# EAGLE design SolarBase731-atmega-v00 (EAGLE 5.10)
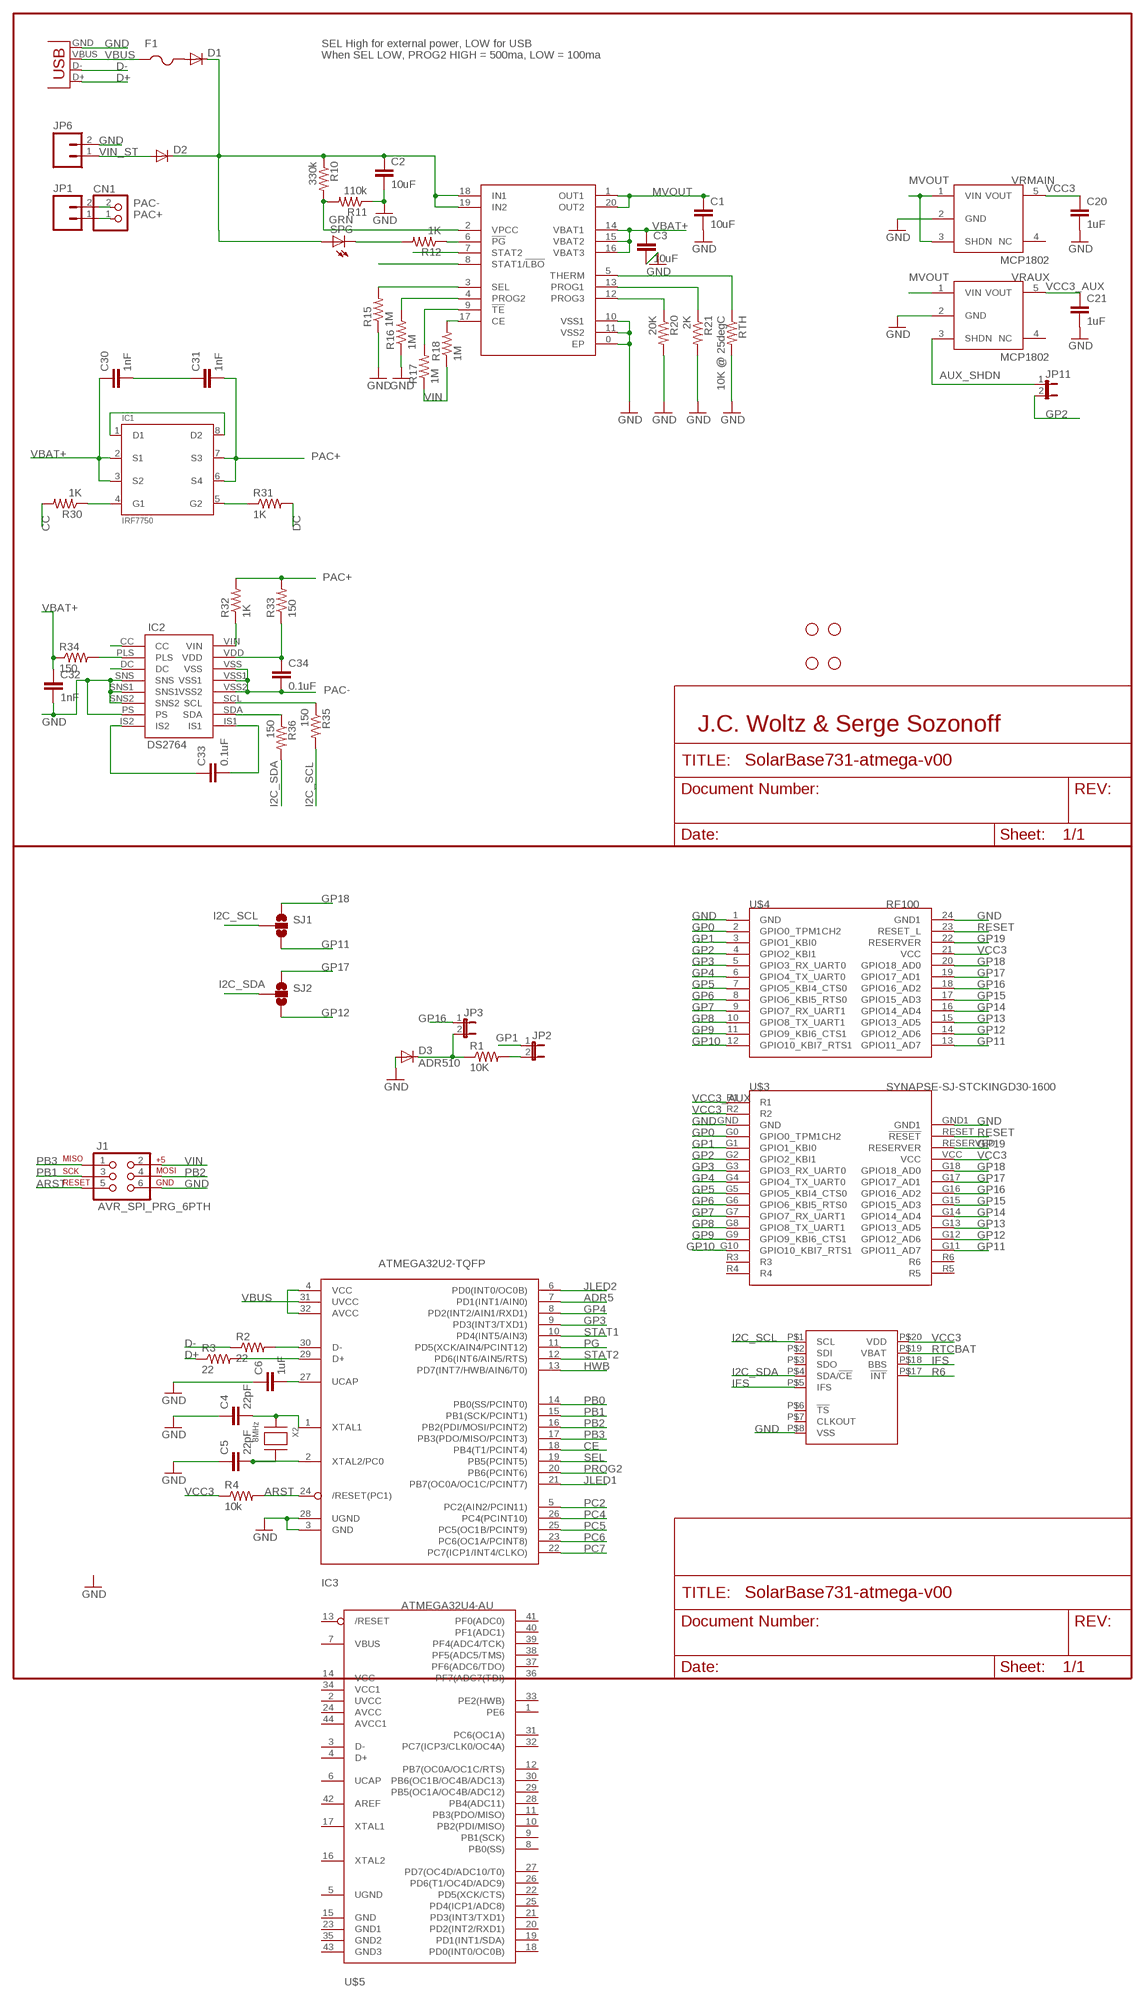
[diagram p0: schematic, sheet 1]

## Parts
C1  10uF  CAP1206  [1206]
C2  10uF  CAP1206  [1206]
C3  10uF  CAP1206  [1206]
C4  22pF  CAP0402-CAP  [0402-CAP]
C5  22pF  CAP0402-CAP  [0402-CAP]
C6  1uF  CAP0603-CAP  [0603-CAP]
C20  1uF  CAP0603-CAP  [0603-CAP]
C21  1uF  CAP0603-CAP  [0603-CAP]
C30  1nF  CAP0603-CAP  [0603-CAP]
C31  1nF  CAP0603-CAP  [0603-CAP]
C32  1nF  CAP0603-CAP  [0603-CAP]
C33  0.1uF  CAP0603-CAP  [0603-CAP]
C34  0.1uF  CAP0603-CAP  [0603-CAP]
CN1  JST_2PIN-THM-RA  [JST-PH-2-THM-RA]
D1  DIODESOD  [SOD-323]
D2  DIODESMA  [SMA-DIODE]
D3  ADR510  DIODESOT-23-3-ADR510  [SOT23-3]
F1  PTCFUSE-1206  [R1206]
IC1  IRF7750  [TSSOP8-4.4MM]
IC2  DS2764  [DS2764]
IC3  ATMEGA32U2-TQFP  [TQFP32-08]
J1  AVR_SPI_PRG_6PTH  [2X3]
JP1  M02PTH  [1X02]
JP2  JUMPER-2SMD-NC  [SJ_2S]
JP3  JUMPER-2SMD-NC  [SJ_2S]
JP4  STAND-OFF  [STAND-OFF]
JP5  STAND-OFF  [STAND-OFF]
JP6  M023.5MM  [SCREWTERMINAL-3.5MM-2]
JP11  JUMPER-2SMD-NC  [SJ_2S]
JP12  STAND-OFF  [STAND-OFF]
JP17  STAND-OFF  [STAND-OFF]
R1  10K  RESISTOR0603-RES  [0603-RES]
R2  22  RESISTOR0603-RES  [0603-RES]
R3  22  RESISTOR0603-RES  [0603-RES]
R4  10k  RESISTOR0603-RES  [0603-RES]
R10  330k  RESISTOR0603-RES  [0603-RES]
R11  110k  RESISTOR0603-RES  [0603-RES]
R12  1K  RESISTOR0603-RES  [0603-RES]
R15  1M  RESISTOR0603-RES  [0603-RES]
R16  1M  RESISTOR0603-RES  [0603-RES]
R17  1M  RESISTOR0603-RES  [0603-RES]
R18  1M  RESISTOR0603-RES  [0603-RES]
R20  20K  RESISTOR0603-RES  [0603-RES]
R21  2K  RESISTOR0603-RES  [0603-RES]
R30  1K  RESISTOR0603-RES  [0603-RES]
R31  1K  RESISTOR0603-RES  [0603-RES]
R32  1K  RESISTOR0603-RES  [0603-RES]
R33  150  RESISTOR0603-RES  [0603-RES]
R34  150  RESISTOR0603-RES  [0603-RES]
R35  150  RESISTOR0603-RES  [0603-RES]
R36  150  RESISTOR0603-RES  [0603-RES]
RTH  10K @ 25degC  RESISTOR0603-RES  [0603-RES]
SJ1  SOLDERJUMPER_2WAYS  [SJ_3]
SJ2  SOLDERJUMPER_2WAYS  [SJ_3]
SPG  GRN  LED0603  [LED-0603]
U$1  PCF2129ASO20  [SO20W]
U$2  MCP73871QFNE  [QFN20]
U$3  SYNAPSE-SJ-STCKINGD30-1600  [SYNSJ-STACK]
U$4  SYNAPSEWIRELESS-RFENGINESTD  SYNAPSEWIRELESS-RFENGINESTDTHM  [SYNAPSERFENGINE-THM]
U$5  ATMEGA32U4-AU  [TQFP44]
VRAUX  MCP1802  [SOT23-5]
VRMAIN  MCP1802  [SOT23-5]
X1  USBSMD  [USB-MINIB]
X2  8MHz  XTALNX5032  [NX5032]

## Nets
!TE: R17.2 U$2.9(!TE)
ADR5: D3.1(C) IC3.7(PD1(INT1/AIN0)) JP3.2 R1.1
ARST: IC3.24(/RESET(PC1)) J1.5 R4.2
AUX_SHDN: JP11.1 VRAUX.3(SHDN)
CC: IC2.CC R30.2
CE: IC3.18(PB4(T1/PCINT4)) R18.2 U$2.17(CE)
D1D2: IC1.1(D1) IC1.8(D2)
D+: R3.1 X1.D+
D-: R2.1 X1.D-
DC: IC2.DC R31.2
DSVDD: C34.1 IC2.VDD R33.1
G1: IC1.4(G1) R30.1
G2: IC1.5(G2) R31.1
GND: C1.2 C2.2 C3.2 C4.1 C5.1 C6.1 C20.2 C21.2 C32.2 D3.2(A) IC2.PS IC2.SNS IC2.SNS1 IC2.SNS2 IC3.3(GND) IC3.28(UGND) J1.6 JP6.2 R11.1 R15.1 R16.1 R20.2 R21.2 RTH.2 U$1.P$8(VSS) U$2.0(EP) U$2.10(VSS1) U$2.11(VSS2) U$3.GND U$3.GND1 U$4.1(GND) U$4.24(GND1) VRAUX.2(GND) VRMAIN.2(GND) X1.GND
GP0: U$3.G0(GPIO0_TPM1CH2) U$4.2(GPIO0_TPM1CH2)
GP1: JP2.1 U$3.G1(GPIO1_KBI0) U$4.3(GPIO1_KBI0)
GP2: JP11.2 U$3.G2(GPIO2_KBI1) U$4.4(GPIO2_KBI1)
GP3: IC3.9(PD3(INT3/TXD1)) U$3.G3(GPIO3_RX_UART0) U$4.5(GPIO3_RX_UART0)
GP4: IC3.8(PD2(INT2/AIN1/RXD1)) U$3.G4(GPIO4_TX_UART0) U$4.6(GPIO4_TX_UART0)
GP5: U$3.G5(GPIO5_KBI4_CTS0) U$4.7(GPIO5_KBI4_CTS0)
GP6: U$3.G6(GPIO6_KBI5_RTS0) U$4.8(GPIO6_KBI5_RTS0)
GP7: U$3.G7(GPIO7_RX_UART1) U$4.9(GPIO7_RX_UART1)
GP8: U$3.G8(GPIO8_TX_UART1) U$4.10(GPIO8_TX_UART1)
GP9: U$3.G9(GPIO9_KBI6_CTS1) U$4.11(GPIO9_KBI6_CTS1)
GP10: U$3.G10(GPIO10_KBI7_RTS1) U$4.12(GPIO10_KBI7_RTS1)
GP11: SJ1.3 U$3.G11(GPIO11_AD7) U$4.13(GPIO11_AD7)
GP12: SJ2.3 U$3.G12(GPIO12_AD6) U$4.14(GPIO12_AD6)
GP13: U$3.G13(GPIO13_AD5) U$4.15(GPIO13_AD5)
GP14: U$3.G14(GPIO14_AD4) U$4.16(GPIO14_AD4)
GP15: U$3.G15(GPIO15_AD3) U$4.17(GPIO15_AD3)
GP16: JP3.1 U$3.G16(GPIO16_AD2) U$4.18(GPIO16_AD2)
GP17: SJ2.1 U$3.G17(GPIO17_AD1) U$4.19(GPIO17_AD1)
GP18: SJ1.1 U$3.G18(GPIO18_AD0) U$4.20(GPIO18_AD0)
GP19: U$3.RESERVED(RESERVER) U$4.22(RESERVER)
HWB: IC3.13(PD7(INT7/HWB/AIN6/T0))
I2C_SCL: R35.2 SJ1.2 U$1.P$1(SCL)
I2C_SDA: R36.2 SJ2.2 U$1.P$4(SDA/!CE)
IFS: U$1.P$5(IFS) U$1.P$18(BBS)
IS1: C33.2 IC2.IS1
IS2: C33.1 IC2.IS2
JLED1: IC3.21(PB7(OC0A/OC1C/PCINT7))
JLED2: IC3.6(PD0(INT0/OC0B))
MVOUT: C1.1 U$2.1(OUT1) U$2.20(OUT2) VRAUX.1(VIN) VRMAIN.1(VIN) VRMAIN.3(SHDN)
N$1: D1.2(A) F1.2
N$4: JP2.2 R1.2
N$8: C6.2 IC3.27(UCAP)
N$15: IC2.VIN R32.1
N$17: IC2.SCL R35.1
N$19: C30.2 C31.1
N$23: R10.2 R11.2 U$2.2(VPCC)
N$25: IC2.SDA R36.1
N$48: IC3.29(D+) R3.2
N$49: IC3.30(D-) R2.2
PAC+ [Vbat]: C31.2 CN1.1 IC1.6(S4) IC1.7(S3) JP1.1 R32.2 R33.2
PAC- [Vbat]: C34.2 CN1.2 IC2.VSS IC2.VSS1 IC2.VSS2 JP1.2
PB0: IC3.14(PB0(SS/PCINT0))
PB1: IC3.15(PB1(SCK/PCINT1)) J1.3
PB2: IC3.16(PB2(PDI/MOSI/PCINT2)) J1.4
PB3: IC3.17(PB3(PDO/MISO/PCINT3)) J1.1
PC2: IC3.5(PC2(AIN2/PCIN11))
PC4: IC3.26(PC4(PCINT10))
PC5: IC3.25(PC5(OC1B/PCINT9))
PC6: IC3.23(PC6(OC1A/PCINT8))
PC7: IC3.22(PC7(ICP1/INT4/CLKO))
PG: IC3.11(PD5(XCK/AIN4/PCINT12)) R12.1 U$2.6(!PG)
PGL: R12.2 SPG.C
PLS: IC2.PLS R34.2
PROG1: R21.1 U$2.13(PROG1)
PROG2: IC3.20(PB6(PCINT6)) R16.2 U$2.4(PROG2)
PROG3: R20.1 U$2.12(PROG3)
R6: U$1.P$17(!INT)
RESET: U$3.RESET(!RESET) U$4.23(RESET_L)
RTCBAT: U$1.P$19(VBAT)
SEL: IC3.19(PB5(PCINT5)) R15.2 U$2.3(SEL)
STAT1: IC3.10(PD4(INT5/AIN3)) U$2.8(STAT1/!LBO)
STAT2: IC3.12(PD6(INT6/AIN5/RTS)) U$2.7(STAT2)
THERM: RTH.1 U$2.5(THERM)
VBAT+ [Vbat]: C3.1 C30.1 C32.1 IC1.2(S1) IC1.3(S2) R34.1 U$2.14(VBAT1) U$2.15(VBAT2) U$2.16(VBAT3)
VBUS: F1.1 IC3.31(UVCC) X1.VBUS
VCC3: C20.1 IC3.4(VCC) IC3.32(AVCC) R4.1 U$1.P$20(VDD) U$3.R2 U$3.VCC U$4.21(VCC) VRMAIN.5(VOUT)
VCC3_AUX: C21.1 U$3.R1 VRAUX.5(VOUT)
VIN: C2.1 D1.1(C) D2.C J1.2 R10.1 R17.1 R18.1 SPG.A U$2.18(IN1) U$2.19(IN2)
VIN_ST: D2.A JP6.1
XTAL1: C4.2 IC3.1(XTAL1) X2.P$1
XTAL2: C5.2 IC3.2(XTAL2/PC0) X2.P$2
Unconnected: U$1.P$2(SDI) U$1.P$3(SDO) U$1.P$6(!TS) U$1.P$7(CLKOUT) U$3.R3 U$3.R4 U$3.R5 U$3.R6 U$5.1(PE6) U$5.2(UVCC) U$5.3(D-) U$5.4(D+) U$5.5(UGND) U$5.6(UCAP) U$5.7(VBUS) U$5.8(PB0(SS)) U$5.9(PB1(SCK)) U$5.10(PB2(PDI/MISO)) U$5.11(PB3(PDO/MISO)) U$5.12(PB7(OC0A/OC1C/RTS)) U$5.13(/RESET) U$5.14(VCC) U$5.15(GND) U$5.16(XTAL2) U$5.17(XTAL1) U$5.18(PD0(INT0/OC0B)) U$5.19(PD1(INT1/SDA)) U$5.20(PD2(INT2/RXD1)) U$5.21(PD3(INT3/TXD1)) U$5.22(PD5(XCK/CTS)) U$5.23(GND1) U$5.24(AVCC) U$5.25(PD4(ICP1/ADC8)) U$5.26(PD6(T1/OC4D/ADC9)) U$5.27(PD7(OC4D/ADC10/T0)) U$5.28(PB4(ADC11)) U$5.29(PB5(OC1A/OC4B/ADC12)) U$5.30(PB6(OC1B/OC4B/ADC13)) U$5.31(PC6(OC1A)) U$5.32(PC7(ICP3/CLK0/OC4A)) U$5.33(PE2(HWB)) U$5.34(VCC1) U$5.35(GND2) U$5.36(PF7(ADC7(TDI)) U$5.37(PF6(ADC6/TDO)) U$5.38(PF5(ADC5/TMS)) U$5.39(PF4(ADC4/TCK)) U$5.40(PF1(ADC1)) U$5.41(PF0(ADC0)) U$5.42(AREF) U$5.43(GND3) U$5.44(AVCC1) VRAUX.4(NC) VRMAIN.4(NC)

## Notes on the sheet
- SEL High for external power, LOW for USB
- When SEL LOW, PROG2 HIGH = 500ma, LOW = 100ma
- J.C. Woltz & Serge Sozonoff

## Library data of the parts
C1-C6 C20 C21 C30-C34 = SparkFun:CAP: Capacitor Standard 0603 ceramic capacitor, and 0.1" leaded capacitor.
CN1 = adafruit:JST_2PIN: JST 2-Pin Connectors of various flavors SMT-RA (S2B-PH-SM4) 4UConnector #17311 SMT (B2B-PH-SM4) THM-RA (S2B-PH) THM (B2B-PH)
D1 D2 = SparkFun:DIODE: Diode These are standard reverse protection diodes and small signal diodes. SMA package can handle up to about 1A. SOD-323 can handle about 200mA. What the SOD-323 package when ordering, there are some mfgs out there that are 5-pin packages.
D3 = 0_jc-modified:DIODE: Diode These are standard reverse protection diodes and small signal diodes. SMA package can handle up to about 1A. SOD-323 can handle about 200mA. What the SOD-323 package when ordering, there are some mfgs out there that are 5-pin packages.
F1 = adafruit:PTCFUSE: PTC fuses, resettable thermistors
IC1 = ssozonoff:IRF7750: HEXFET® power MOSFETs from International Rectifier utilize advanced processing techniques to achieve extremely low on-resistance per silicon area. This benefit, combined with the ruggedized device design, that International Rectifier is well known for, provides the designer with an extremely efficient and reliable device for battery and load management.
IC2 = ssozonoff:DS2764
IC3 = adafruit:ATMEGA32U2: ATmega32u2 Pin compatible with the atmega8u2, atmega16u2 and atmega32u2 8, 16 or 32 K flash, 1K RAM, 512b EEPROM 8 bit and 16 bit timer (5 PWM total) UART, SPI (no I2C!) USB with 4 endpoints, LUFA compatible 22 I/O lines, analog comparator (no ADC!) Comes with DFU bootloader burned in!
J1 = SparkFun:AVR_SPI_PRG_6: AVR ISP 6 Pin This is the reduced ISP connector for AVR programming. Common on Arduino. This footprint will take up less PCB space and can be used with a 10-pin to 6-pin adapter such as SKU: BOB-08508
JP1 JP6 = SparkFun:M02: Header 2 Standard 2-pin 0.1" header. Use with straight break away headers (SKU : PRT-00116), right angle break away headers (PRT-00553), swiss pins (PRT-00743), machine pins (PRT-00117), and female headers (PRT-00115). Molex polarized connector foot print use with SKU : PRT-08233 with associated crimp pins and housings.
JP2 JP3 JP11 = SparkFun:JUMPER-2: Jumper Basic 0.1" spaced jumper. Use with breakaway headers.
JP4 JP5 JP12 JP17 = SparkFun:STAND-OFF: Stand Off This is the mechanical footprint for a #4 phillips button head screw. Use the keepout ring to avoid running the screw head into surrounding components. SKU : PRT-00447
R1-R4 R10-R12 R15-R18 R30-R36 RTH = SparkFun:RESISTOR: Resistor Basic schematic elements and footprints for 0603, 1206, and PTH 1/10th watt (small) resistors.
R20 R21 = 0_jc-custom:RESISTOR
SJ1 SJ2 = SparkFun:SOLDERJUMPER_2WAY: Solder Jumper 2 way solder jumper
SPG = 0_jc-custom:LED: LEDs Standard schematic elements and footprints for 5mm, 3mm, 1206, and 0603 sized LEDs. 5mm - Spark Fun Electronics SKU : COM-00529 (and others)
U$1 = 0_jc-custom:PCF2129A
U$2 = 0_jc-custom:MCP73871
U$3 = 0_jc-custom:SYNAPSE-SJ-STCKING: Standard layout for expansion modules using Synapse Wireless boards
U$4 = 0_jc-custom:SYNAPSEWIRELESS-RFENGINE
U$5 = adafruit:ATMEGA32U4: http://www.ladyada.net/library/eagle
VRAUX VRMAIN = 0_jc-modified:MCP1802
X1 = 0_jc-custom:USB: USB Connectors USB-B-PTH is fully proven SKU : PRT-00139 USB-miniB is fully proven SKU : PRT-00587 USB-A-PCB is untested. USB-A-H is throughly reviewed, but untested. Spark Fun Electronics SKU : PRT-00437 USB-B-SMT is throughly reviewed, but untested. Needs silkscreen touching up. USB-A-S has not been used/tested USB-MB-H has not been used/tested
X2 = adafruit:XTAL: Low cost SMT crystals, no capacitors included http://www.ladyada.net/library/eagle

## Net classes
0 default: width 0.229 mm
1 Vbat: width 0.483 mm

## Board
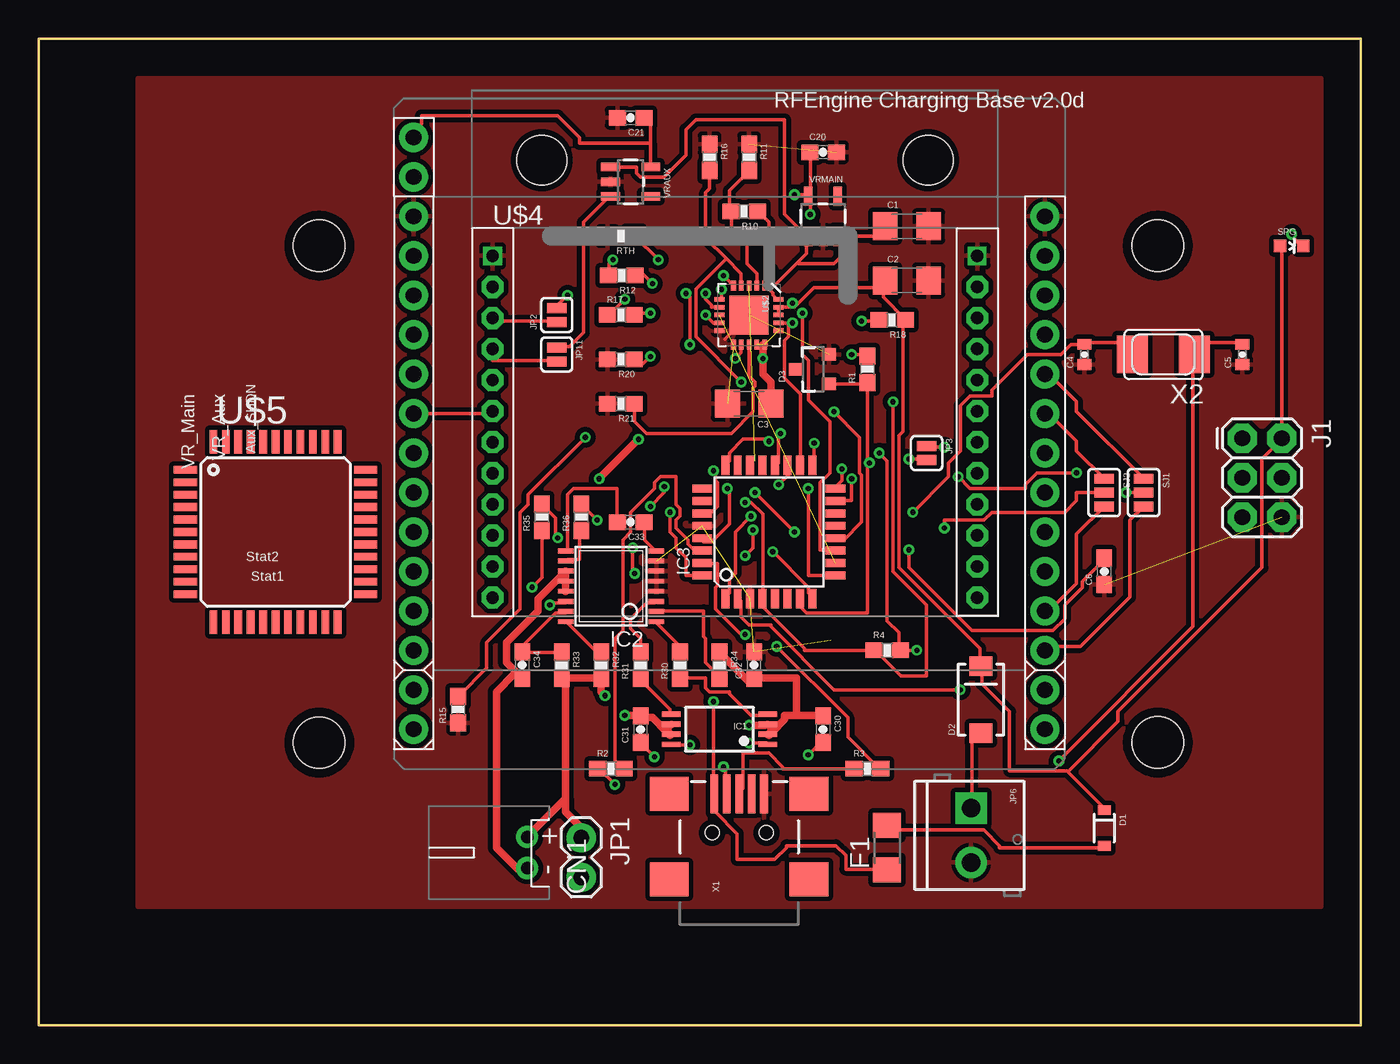
[diagram p1: board, top side]
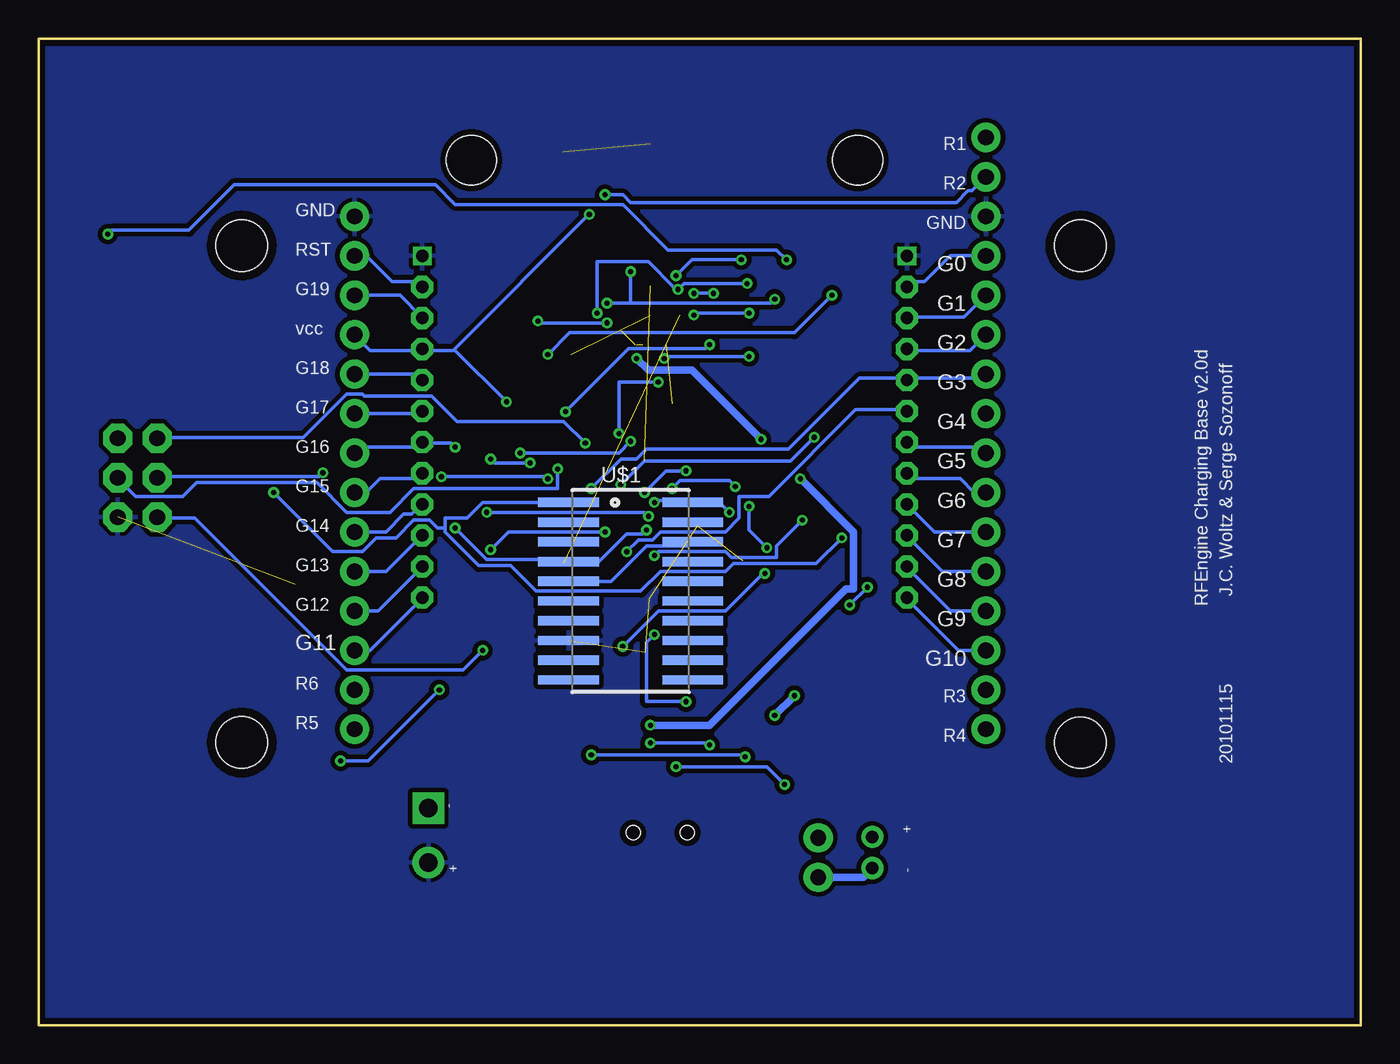
[diagram p2: board, bottom side, seen from below]

Size 85.09 x 63.5 mm. Coordinates in mm from the lower left corner, seen from the top.
Outline: 0,0 85.09,0 85.09,63.5 0,63.5 0,0
Copper layers (1*16): Top 0.0356mm / dielectric 1.5011mm / Bottom 0.0356mm
Design rules "LaenPCBOrder": minimum track width 6mil, minimum drill 13mil, track to track 6mil, track to pad 6mil, pad to pad 6mil, via to via 6mil, smd to smd 6mil, copper to edge 15mil, drill to drill 6mil, minimum pad ring 7mil, minimum via ring 7mil, stop-mask expansion 4mil, vias tented up to drill 0mil, thermal gap 10mil

### Footprints (pad centres in the part's own frame; a part is rotated, then mirrored left to right if it is on the bottom)
1206 = smd 1.6 x 1.8: 1 -1.4,0; 2 1.4,0
0402-CAP = smd 0.7 x 0.9: 1 -0.65,0; 2 0.65,0
0603-CAP = smd 1.1 x 1: 1 -0.85,0; 2 0.85,0
JST-PH-2-THM-RA = drill 0.8 pad 1.422 round: 1 1,0; 2 -1,0
SOD-323 = smd 0.63 x 0.83: 1 -1.15,0; 2 1.15,0
SMA-DIODE = smd 1.27 x 1.47: A -2.15,0; C 2.15,0
SOT23-3 = smd 0.8 x 0.9: 1 -0.95,-1; 2 0.95,-1; 3 0,1.1
R1206 = smd 1.6 x 1.803: 1 -1.422,0; 2 1.422,0
TSSOP8-4.4MM = smd 1.2 x 0.35: 1 -3.1,0.975; 2 -3.1,0.325; 3 -3.1,-0.325; 4 -3.1,-0.975; 5 3.1,-0.975; 6 3.1,-0.325; 7 3.1,0.325; 8 3.1,0.975
DS2764 = smd 0.305 x 0.991: CC -2.275,-2.918; DC -0.975,-2.918; IS1 2.275,2.918; IS2 2.275,-2.918; PLS -1.625,-2.918; PS 1.625,-2.918; SCL -0.975,2.918; SDA 1.625,2.918; SNS -0.325,-2.918; SNS1 0.325,-2.918; SNS2 0.975,-2.918; VDD -1.625,2.918; VIN -2.275,2.918; VSS -0.325,2.918; VSS1 0.325,2.918; VSS2 0.975,2.918
TQFP32-08 = smd 1.27 x 0.508: 1 -4.293,2.8; 2 -4.293,2; 3 -4.293,1.2; 4 -4.293,0.4; 5 -4.293,-0.4; 6 -4.293,-1.2; 7 -4.293,-2; 8 -4.293,-2.8; 17 4.293,-2.8; 18 4.293,-2; 19 4.293,-1.2; 20 4.293,-0.4; 21 4.293,0.4; 22 4.293,1.2; 23 4.293,2; 24 4.293,2.8 | smd 0.508 x 1.27: 9 -2.8,-4.293; 10 -2,-4.293; 11 -1.2,-4.293; 12 -0.4,-4.293; 13 0.4,-4.293; 14 1.2,-4.293; 15 2,-4.293; 16 2.8,-4.293; 25 2.8,4.293; 26 2,4.293; 27 1.2,4.293; 28 0.4,4.293; 29 -0.4,4.293; 30 -1.2,4.293; 31 -2,4.293; 32 -2.8,4.293
2X3 = drill 1.016 pad 1.88 octagon: 1 0,0; 2 0,2.54; 3 2.54,0; 4 2.54,2.54; 5 5.08,0; 6 5.08,2.54
1X02 = drill 1.016 pad 1.88 round: 1 0,0; 2 2.54,0
SJ_2S = smd 0.635 x 1.27: 1 -0.45,0; 2 0.45,0
STAND-OFF = hole 3.302: 0,0
SCREWTERMINAL-3.5MM-2 = drill 1.2 pad 2.032 square: 1 0,0 | drill 1.2 pad 2.032 round: 2 3.5,0
0603-RES = smd 1.1 x 1: 1 -0.85,0; 2 0.85,0
SJ_3 = smd 0.635 x 1.27: 1 -0.889,0; 2 0,0; 3 0.889,0
LED-0603 = smd 0.8 x 0.8: A 0,-0.75; C 0,0.75
SO20W = smd 0.6 x 3.9: P$1 -5.715,-4; P$2 -4.445,-4; P$3 -3.175,-4; P$4 -1.905,-4; P$5 -0.635,-4; P$6 0.635,-4; P$7 1.905,-4; P$8 3.175,-4; P$9 4.445,-4; P$10 5.715,-4; P$11 5.715,4; P$12 4.445,4; P$13 3.175,4; P$14 1.905,4; P$15 0.635,4; P$16 -0.635,4; P$17 -1.905,4; P$18 -3.175,4; P$19 -4.445,4; P$20 -5.715,4
QFN20 = smd 2.5 x 2.5: 0 0,0 | smd 0.65 x 0.3: 1 -1.9,1; 2 -1.9,0.5; 3 -1.9,0; 4 -1.9,-0.5; 5 -1.9,-1; 11 1.9,-1; 12 1.9,-0.5; 13 1.9,0; 14 1.9,0.5; 15 1.9,1 | smd 0.3 x 0.65: 6 -1,-1.9; 7 -0.5,-1.9; 8 0,-1.9; 9 0.5,-1.9; 10 1,-1.9; 16 1,1.9; 17 0.5,1.9; 18 0,1.9; 19 -0.5,1.9; 20 -1,1.9
SYNSJ-STACK = drill 1.016 pad 1.88 round: G0 0,-7.62; G1 0,-10.16; G2 0,-12.7; G3 0,-15.24; G4 0,-17.78; G5 0,-20.32; G6 0,-22.86; G7 0,-25.4; G8 0,-27.94; G9 0,-30.48; G10 0,-33.02; G11 40.64,-33.02; G12 40.64,-30.48; G13 40.64,-27.94; G14 40.64,-25.4; G15 40.64,-22.86; G16 40.64,-20.32; G17 40.64,-17.78; G18 40.64,-15.24; GND 0,-5.08; GND1 40.64,-5.08; R1 0,0; R2 0,-2.54; R3 0,-35.56; R4 0,-38.1; R5 40.64,-38.1; R6 40.64,-35.56; RESERVED 40.64,-10.16; RESET 40.64,-7.62; VCC 40.64,-12.7
SYNAPSERFENGINE-THM = drill 0.8 square: 1 0,0; 24 31.2,0 | drill 0.8 pad 1.422 octagon: 2 0,-2; 3 0,-4; 4 0,-6; 5 0,-8; 6 0,-10; 7 0,-12; 8 0,-14; 9 0,-16; 10 0,-18; 11 0,-20; 12 0,-22; 13 31.2,-22; 14 31.2,-20; 15 31.2,-18; 16 31.2,-16; 17 31.2,-14; 18 31.2,-12; 19 31.2,-10; 20 31.2,-8; 21 31.2,-6; 22 31.2,-4; 23 31.2,-2 | hole 3.2: 3.17,6.16; 28.03,6.16
TQFP44 = smd 1.5 x 0.5: 1 -5.8,4; 2 -5.8,3.2; 3 -5.8,2.4; 4 -5.8,1.6; 5 -5.8,0.8; 6 -5.8,0; 7 -5.8,-0.8; 8 -5.8,-1.6; 9 -5.8,-2.4; 10 -5.8,-3.2; 11 -5.8,-4; 23 5.8,-4; 24 5.8,-3.2; 25 5.8,-2.4; 26 5.8,-1.6; 27 5.8,-0.8; 28 5.8,0; 29 5.8,0.8; 30 5.8,1.6; 31 5.8,2.4; 32 5.8,3.2; 33 5.8,4 | smd 0.5 x 1.5: 12 -4,-5.8; 13 -3.2,-5.8; 14 -2.4,-5.8; 15 -1.6,-5.8; 16 -0.8,-5.8; 17 0,-5.8; 18 0.8,-5.8; 19 1.6,-5.8; 20 2.4,-5.8; 21 3.2,-5.8; 22 4,-5.8; 34 4,5.8; 35 3.2,5.8; 36 2.4,5.8; 37 1.6,5.8; 38 0.8,5.8; 39 0,5.8; 40 -0.8,5.8; 41 -1.6,5.8; 42 -2.4,5.8; 43 -3.2,5.8; 44 -4,5.8
SOT23-5 = smd 0.55 x 1.2: 1 -0.95,-1.3; 2 0,-1.3; 3 0.95,-1.3; 4 0.95,1.3; 5 -0.95,1.3
USB-MINIB = smd 2.5 x 0.5: D+ 2.5,0; D- 2.5,0.8; GND 2.5,-1.6; ID 2.5,-0.8; VBUS 2.5,1.6 | smd 2.2 x 2.5: GND@1 -3,-4.5; GND@2 -3,4.5; GND@3 2.5,4.5; GND@4 2.5,-4.5 | hole 0.9: 0,1.75; 0,-1.75
NX5032 = smd 2 x 2.4: P$1 2,0; P$2 -2,0

### Placement (x,y rotation side)
C1  55.88,51.44 0 top
C2  55.88,47.94 0 top
C3  45.72,40.01 180 top
C4  67.31,43.18 90 top
C5  77.47,43.18 90 top
C6  68.58,29.21 90 top
C20  50.48,56.2 0 top
C21  38.1,58.42 180 top
C30  50.48,19.05 270 top
C31  38.73,19.05 90 top
C32  46.04,23.18 90 top
C33  38.1,32.38 180 top
C34  31.11,23.18 270 top
CN1  31.43,11.11 90 top
D1  68.58,12.7 270 top
D2  60.64,20.95 90 top
D3  49.85,42.23 90 top
F1  54.61,11.43 90 top
IC1  43.81,19.05 180 top
IC2  36.83,28.26 90 top
IC3  46.99,31.75 90 top
J1  77.47,37.78 270 top
JP1  34.92,12.06 270 top
JP2  33.34,45.72 90 top
JP3  57.15,36.83 270 top
JP4  72.03,50.19 0 top
JP5  18.05,50.19 0 top
JP6  60.01,13.97 270 top
JP11  33.34,43.18 270 top
JP12  72.03,18.2 0 top
JP17  18.05,18.19 0 top
R1  53.34,42.23 90 top
R2  36.83,16.51 0 top
R3  53.34,16.51 0 top
R4  54.61,24.13 0 top
R10  45.4,52.39 180 top
R11  45.72,55.88 270 top
R12  37.53,48.26 180 top
R15  26.99,20.32 90 top
R16  43.18,55.88 270 top
R17  37.47,45.72 0 top
R18  54.93,45.4 180 top
R20  37.47,42.86 180 top
R21  37.47,40.01 180 top
R30  41.27,23.18 90 top
R31  38.73,23.18 90 top
R32  36.2,23.18 270 top
R33  33.66,23.18 270 top
R34  43.81,23.18 270 top
R35  32.38,32.7 90 top
R36  34.92,32.7 90 top
RTH  37.47,50.8 180 top
SJ1  71.12,34.29 270 top
SJ2  68.58,34.29 270 top
SPG  80.64,50.16 270 top
U$1  46.99,27.94 270 bottom
U$2  45.72,45.72 270 top
U$3  24.13,57.15 0 top
U$4  29.21,49.53 0 top
U$5  15.24,31.75 0 top
VRAUX  38.1,54.29 270 top
VRMAIN  50.48,52.07 0 top
X1  45.09,12.38 90 top
X2  72.39,43.18 180 top

### Tracks (layer width: path | path; a pad name or v marks a point on that pad's centre or on a via)
!TE  (via drill 0.33)
  Top 0.229: v42.93,45.72 43.43,45.21 U$2.9 | v39.37,45.85 38.35,45.85 38.35,45.72 R17.2
  Bottom 0.229: v42.93,45.72 42.8,45.85 v39.37,45.85
ADR5  (via drill 0.33)
  Top 0.229: 53.34,41.27 50.93,41.27 D3.1 | 53.34,41.27 R1.1 53.34,41.27 | 53.34,36.2 53.34,41.27 | 53.34,36.2 53.34,26.54 49.4,26.54 49.15,26.8 49.15,27.3 49.02,27.43 IC3.7 | v56.01,36.45 57.15,36.45 JP3.2 | 53.34,36.2 v53.47,36.2
  Bottom 0.229: v56.01,36.45 55.75,36.2 v53.47,36.2
ARST  (via drill 0.33)
  Top 0.229: v56.52,24.13 55.5,24.13 R4.2 55.37,24.13 55.37,25.27 54.61,26.04 54.61,36.32 v54.1,36.83 | v46.99,37.59 46.99,37.72 45.34,37.72 44.45,36.83 44.45,36.32 44.2,36.07 IC3.24
  Bottom 0.229: v56.52,24.13 57.78,22.86 65.28,22.86 75.06,32.64 77.47,32.64 J1.5 | v46.99,37.59 47.75,36.83 v54.1,36.83
AUX_SHDN
  Top 0.229: VRAUX.3 36.7,53.34 35.05,51.69 35.05,44.58 34.16,43.69 33.4,43.69 JP11.1
CC
  Top 0.229: IC2.CC 39.75,25.91 41.27,24.38 41.27,24.13 R30.2
CE  (via drill 0.33)
  Top 0.229: 48.26,44.96 48.26,44.32 48.01,44.07 48.01,41.66 49.02,40.64 49.02,36.07 IC3.18 | 48.26,44.96 48.26,45.21 U$2.17 | v52.96,45.34 53.98,45.34 R18.2 | 48.26,44.96 v48.51,45.21
  Bottom 0.229: v52.96,45.34 52.83,45.21 v48.51,45.21
D1D2  (via drill 0.33)
  Top 0.229: v41.91,18.03 40.77,18.03 IC1.8 | v45.72,18.16 46.86,18.16 IC1.1
  Bottom 0.229: v41.91,18.03 42.04,18.16 v45.72,18.16
D+
  Top 0.229: R3.1 52.45,16.51 47.88,16.51 47.88,16.64 46.99,17.53 45.34,17.53 45.34,15.24 45.09,14.99 X1.D+
D-  (via drill 0.33)
  Top 0.229: v37.08,15.49 36.07,16.51 R2.1 | v44.07,16.64 44.2,16.51 44.2,14.99 X1.D-
  Bottom 0.229: v37.08,15.49 38.23,16.64 v44.07,16.64
DC
  Top 0.229: IC2.DC 39.62,27.18 39.12,27.18 38.1,26.16 38.1,25.53 38.73,24.89 38.73,24.13 R31.2
DSVDD
  Top 0.229: IC2.VDD 33.91,26.54 33.27,26.54 31.11,24.38 31.11,24.13 C34.1 31.11,24 33.66,24 R33.1
G1
  Top 0.229: R30.1 41.27,22.35 42.93,22.35 42.93,21.72 43.18,21.46 44.45,21.46 44.45,21.34 45.85,19.94 46.86,19.94 IC1.4
G2
  Top 0.229: R31.1 38.73,22.23 40.64,20.32 40.64,20.07 IC1.5
GND  (8 unrouted)
  Top 0.229: U$2.0 44.2,44.2 44.16,44.16
  pour Top (isolate 0.305): 6.35,7.62 6.35,60.96 82.55,60.96 82.55,7.62
  pour Bottom (isolate 0.305): 0,63.5 0,0 85.09,0 85.09,63.5
GP0
  Bottom 0.229: U$3.G0 26.42,49.53 28.07,47.88 28.96,47.88 29.21,47.62 U$4.2
GP1
  Top 0.229: JP2.1 33.27,45.34 29.21,45.34 29.21,45.47 U$4.3
  Bottom 0.229: U$3.G1 25.53,45.59 29.21,45.59 U$4.3
GP2
  Top 0.229: JP11.2 33.27,42.8 29.21,42.8 29.21,43.43 U$4.4
  Bottom 0.229: U$3.G2 25.15,43.43 29.21,43.43 U$4.4
GP3  (via drill 0.33)
  Top 0.229: v49.53,34.54 49.53,28.96 51.18,28.96 IC3.9
  Bottom 0.229: v49.53,34.54 47.62,36.45 46.61,36.45 45.97,37.08 36.83,37.08 32.26,41.66 29.21,41.66 | 29.21,41.66 U$4.5 29.21,41.66 | U$3.G3 24.38,41.66 29.21,41.66
GP4  (via drill 0.33)
  Top 0.229: v47.24,30.48 49.53,28.19 49.53,27.81 49.78,27.56 IC3.8 | U$3.G4 29.21,39.37 29.21,39.5 U$4.6
  Bottom 0.229: v47.24,30.48 46.48,31.24 45.59,31.24 45.09,31.75 40.89,31.75 40.01,32.64 40.01,34.04 38.1,34.04 32.51,39.62 29.21,39.62 U$4.6
GP5
  Bottom 0.229: U$3.G5 24.64,36.83 25.02,37.21 28.96,37.21 29.21,37.47 U$4.7
GP6
  Bottom 0.229: U$3.G6 24.89,34.29 25.78,35.18 28.96,35.18 29.21,35.43 U$4.8
GP7
  Bottom 0.229: U$3.G7 27.43,31.75 U$4.9
GP8
  Bottom 0.229: U$3.G8 26.92,29.21 29.21,31.5 U$4.10
GP9
  Bottom 0.229: U$3.G9 26.42,26.67 29.21,29.46 U$4.11
GP10
  Bottom 0.229: U$3.G10 25.91,24.13 29.21,27.43 U$4.12
GP11
  Top 0.229: SJ1.3 70.23,32.51 70.23,27.56 67.06,24.38 64.77,24.38 U$3.G11
  Bottom 0.229: U$3.G11 63.75,24.13 60.45,27.43 U$4.13
GP12
  Top 0.229: SJ2.3 66.8,31.62 66.8,28.45 65.02,26.67 U$3.G12
  Bottom 0.229: U$3.G12 63.25,26.67 60.45,29.46 U$4.14
GP13
  Bottom 0.229: U$3.G13 62.74,29.21 60.45,31.5 U$4.15
GP14
  Bottom 0.229: U$3.G14 62.74,31.75 61.59,32.89 61.09,32.89 60.45,33.53 U$4.16
GP15
  Bottom 0.229: U$3.G15 64.01,34.29 63.12,35.18 60.71,35.18 60.45,35.43 U$4.17
GP16  (via drill 0.33)
  Top 0.229: v58.29,37.21 57.15,37.21 JP3.1
  Bottom 0.229: v58.29,37.21 58.55,37.47 60.33,37.47 U$4.18 60.45,37.47 60.71,37.21 63.88,37.21 64.26,36.83 U$3.G16
GP17
  Top 0.229: SJ2.1 66.8,36.96 66.8,37.59 65.02,39.37 U$3.G17
  Bottom 0.229: U$3.G17 60.58,39.37 60.45,39.5 U$4.19
GP18
  Top 0.229: SJ1.1 66.8,39.5 66.8,40.13 65.02,41.91 U$3.G18
  Bottom 0.229: U$3.G18 60.71,41.91 60.45,41.66 U$4.20
GP19
  Bottom 0.229: U$3.RESERVED 61.85,46.99 60.45,45.59 U$4.22
I2C_SCL  (via drill 0.33)
  Top 0.229: v33.4,31.37 33.27,31.5 33.27,32.64 32.38,33.53 R35.2 | v69.98,34.29 SJ1.2
  Bottom 0.229: v33.4,31.37 35.05,29.72 40.39,29.72 40.89,29.21 45.09,29.21 46.35,27.94 53.09,27.94 54.74,29.59 56.77,29.59 58.93,31.75 58.93,32 | 58.93,32 58.93,32.64 57.53,32.64 56.52,33.66 51.05,33.66 U$1.P$1 | v69.98,34.29 66.17,30.48 64.26,30.48 63.37,31.37 62.1,31.37 60.96,32.51 59.94,32.51 59.44,32 58.93,32
I2C_SDA  (via drill 0.33)
  Top 0.229: v35.94,32.51 34.92,33.53 R36.2 | v45.47,30.23 45.97,30.73 v45.97,31.88 | SJ2.2 66.8,34.29 66.8,33.78 66.04,33.02 61.34,33.02 60.83,32.51 58.29,32.51 v58.29,32
  Bottom 0.229: v35.94,32.51 37.59,30.86 37.59,30.1 40.51,30.1 40.89,30.48 45.21,30.48 v45.47,30.23 | v45.97,31.88 46.23,31.62 47.24,31.62 49.02,29.84 50.93,29.84 U$1.P$4 51.05,29.84 51.18,29.97 56.26,29.97 v58.29,32
IFS
  Bottom 0.229: U$1.P$18 43.05,31.11 43.31,30.86 45.97,30.86 48.26,28.57 50.93,28.57 U$1.P$5
IS1
  Top 0.229: IC2.IS1 34.04,30.61 34.04,34.16 34.42,34.54 37.21,34.54 37.21,32.38 C33.2
IS2
  Top 0.229: IC2.IS2 39.62,30.61 38.99,31.24 38.99,32.38 C33.1
MVOUT
  Top 0.229: C1.1 54.36,51.44 54.36,50.8 51.44,50.8 VRMAIN.3 51.44,50.67 51.56,50.55 51.56,49.4 51.18,49.02 48.9,49.02 48.83,49.09 | 47.05,47.31 46.74,47.62 U$2.1 | 47.05,47.31 47.24,47.12 47.24,46.99 47.5,46.74 U$2.20 | VRAUX.1 36.83,55.24 38.48,55.24 38.48,54.86 38.73,54.61 40.26,54.61 41.66,56.01 41.66,57.66 42.29,58.29 48.01,58.29 48.01,52.2 49.53,50.67 VRMAIN.1 49.4,50.67 49.4,49.66 48.83,49.09 | 48.83,49.09 47.12,47.37 47.05,47.31
N$1
  Top 0.229: D1.2 68.58,11.43 61.85,11.43 61.85,11.56 60.83,12.57 54.61,12.57 54.61,12.83 F1.2
N$4  (via drill 0.33)
  Top 0.229: v52.32,43.18 53.34,43.18 R1.2 | v34.04,46.99 33.4,46.35 33.4,46.23 JP2.2
  Bottom 0.229: v52.32,43.18 50.93,44.58 36.45,44.58 v34.04,46.99
N$8  (via drill 0.33)
  Top 0.229: v56.01,30.61 56.01,29.46 60.07,25.4 65.28,25.4 66.04,26.16 66.04,27.05 67.18,28.19 67.18,28.57 68.58,29.97 C6.2 | v46.1,34.29 v48.64,31.75 | v43.43,35.69 43.56,35.56 43.56,35.05 43.69,34.92 43.69,33.4 43.31,33.02 42.8,33.02 IC3.27
  Bottom 0.229: v56.01,30.61 54.86,31.75 v48.64,31.75 | v46.1,34.29 44.7,35.69 v43.43,35.69
N$15
  Top 0.229: IC2.VIN 34.04,25.91 35.81,24.13 36.2,24.13 R32.1
N$17  (via drill 0.33)
  Top 0.229: v32.89,27.05 32.89,27.18 33.91,27.18 IC2.SCL | v31.75,28.19 32.38,28.83 32.38,31.75 R35.1
  Bottom 0.229: v32.89,27.05 v31.75,28.19
N$19  (via drill 0.33)
  Top 0.229: v39.62,17.27 38.73,18.16 C31.1 | v49.53,17.4 50.42,18.29 C30.2
  Bottom 0.229: v39.62,17.27 39.75,17.4 v49.53,17.4
N$23
  Top 0.229: U$2.2 46.23,48.39 45.59,49.02 45.59,50.29 44.58,51.31 44.58,52.32 R10.2 44.45,52.45 44.45,53.72 45.72,54.99 R11.2
N$25
  Top 0.229: IC2.SDA 34.04,29.97 34.8,29.97 34.8,31.62 34.92,31.75 R36.1
N$48  (via drill 0.33)
  Top 0.229: v47.5,24.38 52.07,19.81 52.07,18.54 54.1,16.51 R3.2 | v38.35,29.08 38.23,29.21 v38.23,30.73 | v39.37,33.4 40.26,34.29 v40.26,34.67 | v44.32,34.54 44.45,34.42 44.45,32.26 43.31,31.11 42.8,31.11 42.8,31.24 IC3.29
  Bottom 0.229: v47.5,24.38 45.21,26.67 40.89,26.67 38.48,29.08 v38.35,29.08 | v38.23,30.73 39.37,31.88 v39.37,33.4 | v40.26,34.67 40.64,35.05 43.81,35.05 v44.32,34.54
N$49
  Top 0.229: R2.2 37.59,16.51 37.08,17.02 37.08,24.89 37.59,25.4 37.59,31.24 38.1,31.75 38.1,33.02 39.62,34.54 39.62,34.92 40.01,35.31 41.02,35.31 41.02,33.53 41.27,33.27 41.27,32.77 41.02,32.51 41.02,32 41.78,31.24 41.78,30.99 42.16,30.61 42.67,30.61 IC3.30
PAC+  (via drill 0.33)
  Top 0.483: 40.39,18.92 40.64,18.67 IC1.7 | 40.39,18.92 39.5,19.81 38.73,19.81 C31.2 38.61,19.94 v37.72,19.94 | IC1.6 40.64,19.3 40.51,19.18 40.51,19.05 40.39,18.92 | 33.91,14.48 33.91,13.72 34.92,12.7 JP1.1 | 33.91,14.48 33.91,21.84 33.66,22.1 R33.2 33.66,22.35 36.2,22.35 R32.2 36.2,22.1 36.2,21.46 v36.45,21.21 | CN1.1 31.5,12.19 33.78,14.48 33.91,14.48
  Bottom 0.483: v36.45,21.21 v37.72,19.94
PAC-
  Top 0.483: IC2.VSS IC2.VSS1 33.91,28.83 33.91,29.21 IC2.VSS2 33.78,29.08 32.13,27.43 32.13,26.67 30.1,24.64 30.1,23.37 30.73,22.73 | 30.73,22.73 31.11,22.35 C34.2 | 30.73,22.73 30.61,22.61 29.46,21.46 29.46,11.43 30.86,10.03 31.37,10.03 CN1.2
  Bottom 0.483: JP1.2 32,9.53 31.5,10.03 CN1.2
PB1  (via drill 0.33)
  Top 0.229: v52.32,35.18 52.32,33.78 51.31,33.78 IC3.15 | v59.18,35.31 59.94,34.54 63.5,34.54 63.5,34.8 64.26,35.56 v66.8,35.56
  Bottom 0.229: v52.32,35.18 52.45,35.31 v59.18,35.31 | v66.8,35.56 67.06,35.31 77.47,35.31 J1.3
PB2  (via drill 0.33)
  Top 0.229: v51.69,35.81 51.69,35.05 51.31,34.67 IC3.16
  Bottom 0.229: v51.69,35.81 51.69,34.54 60.96,34.54 62.48,33.02 65.28,33.02 67.18,34.92 74.93,34.92 75.82,34.04 78.87,34.04 80.01,35.18 J1.4
PB3  (via drill 0.33)
  Top 0.229: v49.91,37.47 49.91,36.07 IC3.17
  Bottom 0.229: v49.91,37.47 51.31,38.86 58.17,38.86 59.82,40.51 64.14,40.51 64.26,40.64 65.28,40.64 68.07,37.85 77.47,37.85 J1.1
PG  (via drill 0.33)
  Top 0.229: v43.94,47.37 43.94,46.74 U$2.6 | v39.5,47.75 38.86,48.39 38.48,48.39 38.48,48.26 R12.1 | v49.15,45.85 49.15,43.18 49.53,42.8 49.53,40.26 50.93,38.86 50.93,35.56 50.29,34.92 50.29,30.61 51.18,30.61 IC3.11
  Bottom 0.229: v39.5,47.75 43.56,47.75 v43.94,47.37 43.94,47.5 44.2,47.5 45.85,49.15 49.15,49.15 v49.15,45.85
PGL  (via drill 0.33)
  Top 0.229: v80.64,50.93 80.64,50.8 81.28,50.16 SPG.C | v36.96,49.28 36.7,49.02 36.7,48.26 R12.2
  Bottom 0.229: v80.64,50.93 80.39,51.18 75.44,51.18 72.52,54.1 59.56,54.1 58.29,52.83 47.5,52.83 44.58,49.91 37.59,49.91 v36.96,49.28
PLS
  Top 0.229: IC2.PLS 39.75,26.67 42.8,26.67 42.8,25.02 42.93,24.89 42.93,23.37 43.81,22.48 43.81,22.35 R34.2
PROG1
  Top 0.229: U$2.13 45.72,41.78 46.1,41.4 46.1,41.15 45.97,41.02 45.97,39.5 44.58,38.1 39.12,38.1 38.35,38.86 38.35,40.01 R21.1
PROG2  (via drill 0.33)
  Top 0.229: 44.26,49.34 42.93,50.67 42.93,53.59 43.18,53.85 43.18,54.99 R16.2 | 44.26,49.34 45.21,48.39 U$2.4 | v47.75,38.1 47.62,37.97 47.62,36.2 47.5,36.07 IC3.20 | v45.21,41.4 42.29,44.32 42.29,47.37 44.2,49.28 44.26,49.34
  Bottom 0.229: v47.75,38.1 47.75,41.4 v45.21,41.4
PROG3  (via drill 0.33)
  Top 0.229: v44.83,42.93 45.21,43.31 U$2.12 | v39.37,43.05 38.86,42.55 38.35,42.55 38.35,42.8 R20.1
  Bottom 0.229: v44.83,42.93 44.7,43.05 v39.37,43.05
RESET
  Bottom 0.229: U$3.RESET 64.01,49.53 62.36,47.88 60.71,47.88 60.45,47.62 U$4.23
SEL  (via drill 0.33)  (1 unrouted)
  Top 0.229: v35.18,37.85 31.5,34.16 31.5,33.53 30.99,33.02 30.99,26.8 28.83,24.64 28.83,22.99 27.05,21.21 R15.2 | v47.62,34.8 48.26,35.43 48.26,35.94 IC3.19
  Bottom 0.229: v35.18,37.85 36.7,36.32 46.1,36.32 v47.62,34.8
STAT1  (1 unrouted)
STAT2  (via drill 0.33)
  Top 0.229: v42.93,47.12 42.93,46.74 43.31,46.35 43.31,46.23 U$2.7 | v41.66,47.12 41.91,46.86 v41.91,43.81 | v51.18,39.5 52.83,37.85 52.83,35.56 52.96,35.43 52.96,32.38 51.82,31.24 51.31,31.24 IC3.12
  Bottom 0.229: v41.66,47.12 v42.93,47.12 | v41.91,43.81 42.16,43.56 47.12,43.56 v51.18,39.5
THERM  (via drill 0.33)
  Top 0.229: v44.07,48.26 44.7,47.62 U$2.5 | v39.88,49.28 38.35,50.8 RTH.1
  Bottom 0.229: v44.07,48.26 43.05,49.28 v39.88,49.28
VBAT+  (via drill 0.33)  (2 unrouted)
  Top 0.483: U$2.15 46.61,43.81 v46.61,42.93 46.61,41.91 47.12,41.4 C3.1 | 48.77,19.94 48.01,19.94 48.01,19.68 47.24,18.92 | 48.77,19.94 50.42,19.94 C30.1 | 47.24,18.92 46.99,18.67 IC1.2 | 48.77,19.94 48.77,20.07 48.77,22.35 46.1,22.35 C32.1 45.85,22.23 45.85,22.1 45.72,22.1 43.81,24 R34.1 | 47.24,18.92 47.12,19.05 47.12,19.18 46.99,19.3 IC1.3 46.74,19.3 v45.72,19.3 | v36.07,35.18 v38.61,37.72
  Bottom 0.483: v46.61,42.93 45.85,42.16 43.05,42.16 v38.61,37.72 | v36.07,35.18 32.64,31.75 32.64,28.07 33.15,28.07 41.91,19.3 v45.72,19.3
VBUS  (via drill 0.33)
  Top 0.229: v45.47,25.15 45.21,25.15 43.56,26.8 43.56,28.19 43.69,28.32 43.69,29.72 42.8,29.72 IC3.31 | v43.43,20.83 43.43,14.99 X1.VBUS 43.56,14.86 43.56,13.72 44.96,12.32 44.96,10.67 47.37,10.67 48.13,11.43 48.13,11.56 51.31,11.56 51.94,10.92 51.94,10.03 54.61,10.03 F1.1
  Bottom 0.229: v45.47,25.15 45.97,24.64 45.97,20.83 v43.43,20.83
VCC3  (via drill 0.33)
  Top 0.229: v40.64,33.02 40.64,31.75 41.02,31.37 41.02,30.73 41.66,30.1 41.66,28.96 42.67,28.96 IC3.32 | v45.47,33.66 45.85,33.66 46.61,32.89 46.61,27.56 IC3.4 46.61,27.43 46.61,26.92 49.28,24.26 49.28,24.13 53.72,24.13 R4.1 53.85,24.13 55.5,22.48 57.15,22.48 57.15,27.05 54.99,29.21 v54.99,40.13 | C20.1 49.66,56.13 49.66,53.47 VRMAIN.5 | v49.66,52.2 49.66,53.34 VRMAIN.5 | v48.64,53.47 49.53,53.47 VRMAIN.5
  Bottom 0.229: v40.64,33.02 41.27,33.66 42.93,33.66 U$1.P$20 43.05,33.66 43.18,33.78 45.34,33.78 v45.47,33.66 | 58.36,43.5 58.42,43.43 60.33,43.43 U$4.21 60.45,43.43 63.75,43.43 U$3.VCC | 58.36,43.5 v49.66,52.2 | U$3.R2 25.02,53.72 25.27,53.72 26.04,52.96 46.99,52.96 47.5,53.47 v48.64,53.47 | v54.99,40.13 58.29,43.43 58.36,43.5
VCC3_AUX
  Top 0.229: 39.37,56.77 39.37,55.24 VRAUX.5 | 39.37,56.77 39.37,58.04 38.99,58.42 C21.1 | 39.37,56.77 34.8,56.77 34.8,57.15 33.4,58.55 24.64,58.55 24.64,58.04 24.13,57.53 U$3.R1
VIN  (via drill 0.33)
  Top 0.229: U$2.18 47.62,46.1 U$2.19 48.64,46.23 48.7,46.29 | 48.7,46.29 49.91,47.5 54.36,47.5 | 54.36,47.5 54.36,47.88 C2.1 54.36,47.5 | v37.72,46.74 36.7,45.72 R17.1 | v48.51,46.48 48.64,46.35 48.7,46.29 | 54.36,47.5 54.36,46.86 55.75,45.47 R18.1 55.75,45.34 55.63,45.21 55.63,38.23 55.37,37.97 55.37,29.46 60.58,24.26 60.58,23.11 D2.C 60.71,22.99 60.71,21.97 62.48,20.19 62.48,16.38 66.17,16.38 66.23,16.32 | v46.99,48.51 46.99,51.69 46.35,52.32 R10.1 | 66.23,16.32 68.58,13.97 D1.1 | SPG.A 80.01,50.16 80.01,37.85 J1.2 80.01,37.72 78.74,36.45 78.74,29.46 69.47,20.19 69.47,19.56 66.29,16.38 66.23,16.32
  Bottom 0.229: v37.72,46.74 37.97,46.48 46.99,46.48 | v48.51,46.48 46.99,46.48 | 46.99,46.48 v46.99,48.51
VIN_ST
  Top 0.229: D2.A 60.58,18.8 60.07,18.29 60.07,13.97 JP6.1
XTAL1  (via drill 0.33)
  Top 0.229: X2.P$1 70.36,43.18 70.36,43.94 67.31,43.94 C4.2 67.31,43.81 66.42,43.81 65.79,43.18 63.63,43.18 61.34,40.89 61.34,40.51 59.94,40.51 59.31,39.88 59.31,36.96 58.55,36.2 58.55,35.31 v56.26,33.02 | v45.85,32.77 44.83,31.75 44.83,29.08 44.45,28.7 44.45,27.81 44.2,27.56 IC3.1
  Bottom 0.229: v45.85,32.77 46.1,33.02 v56.26,33.02
XTAL2  (via drill 0.33)
  Top 0.229: C5.2 77.47,43.94 74.42,43.94 74.42,43.18 X2.P$2 74.3,43.18 74.3,25.65 v65.66,17.02 | v59.31,21.59 51.18,21.59 47.12,25.65 47.12,25.78 45.72,25.78 45.21,26.29 45.21,27.3 45.09,27.43 IC3.2
  Bottom 0.229: v59.31,21.59 63.88,17.02 v65.66,17.02

### Text on the board
tPlace: RFEngine Charging Base v2.0d | VR_Main | VR_Aux | Aux_SHDN | Stat2 | Stat1
bPlace: R1 | R2 | GND | GND | G0 | RST | G1 | G19 | G2 | vcc | G3 | G18 | G4 | G17 | G5 | G16 | G6 | G15 | G7 | G14 | G8 | G13 | J.C. Woltz & Serge Sozonoff | RFEngine Charging Base v2.0d | G9 | G12 | G10 | G11 | R3 | R6 | R4 | R5 | 20101115 | - | + | - | +